# Altium schematic sheet 0026_DDR5 SODIMM CONTRO.SchDoc
size A3
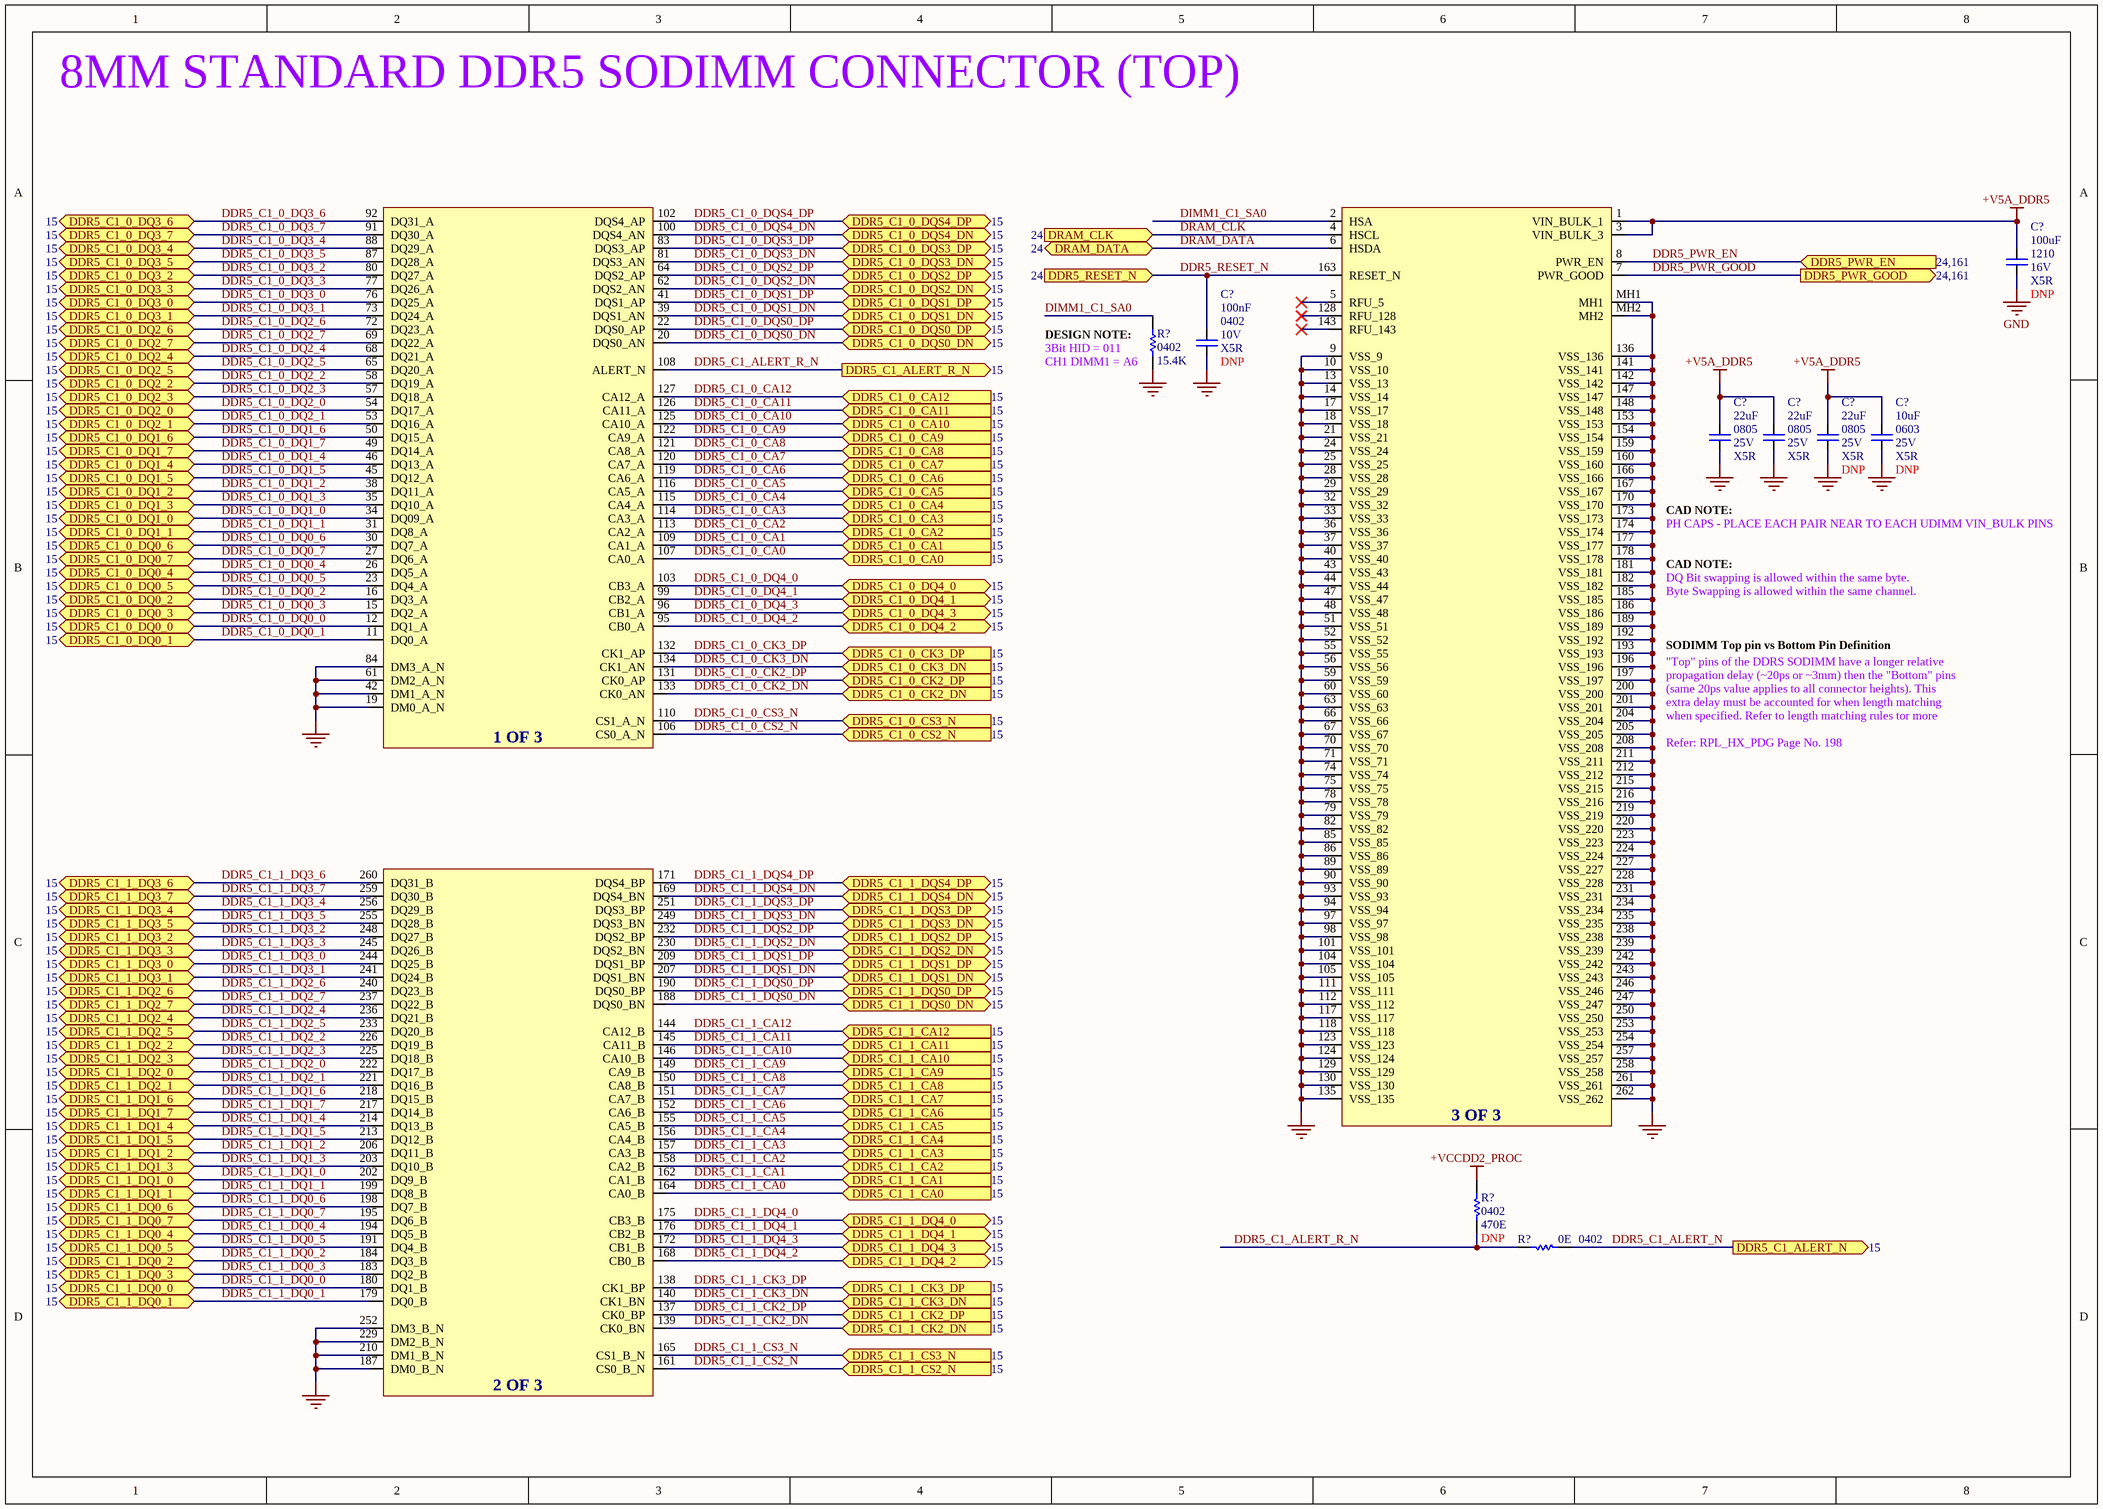
[diagram p0: 0026_DDR5 SODIMM CONTRO.SchDoc]

## Parts
(Parts that share a designator on the sheet are numbered #1, #2 ... from top to bottom, then left to right.)
C?#1  value 100uF  Case/Package: 1210  Voltage: 16V  Dielectric: X5R
C?#2  value 100nF  Case/Package: 0402  Voltage: 10V  Dielectric: X5R  [CAPC0402]
C?#3  value 22uF  Case/Package: 0805  Voltage: 25V  Dielectric: X5R  [capc0805]
C?#4  value 22uF  Case/Package: 0805  Voltage: 25V  Dielectric: X5R  [capc0805]
C?#5  value 22uF  Case/Package: 0805  Voltage: 25V  Dielectric: X5R  [capc0805]
C?#6  value 10uF  Case/Package: 0603  Voltage: 25V  Dielectric: X5R  [capc0603]
J?#1  C_DDR5_SODIMM_2X131_2EM  (value not drawn)  (part A of 3)
J?#2  C_DDR5_SODIMM_2X131_2EM  (value not drawn)  (part C of 3)
J?#3  C_DDR5_SODIMM_2X131_2EM  (value not drawn)  (part B of 3)
R?#1  value 15.4K  Case/Package: 0402  [RESC0402]  (hidden comment: Res)
R?#2  value 470E  Case/Package: 0402  [RESC0402]  (hidden comment: Res)
R?#3  value 0E  Case/Package: 0402  [RESC0402]  (hidden comment: Res)

## Ports
DDR5_C1_0_CA0 (in), DDR5_C1_0_CA1 (in), DDR5_C1_0_CA2 (in), DDR5_C1_0_CA3 (in), DDR5_C1_0_CA4 (in), DDR5_C1_0_CA5 (in), DDR5_C1_0_CA6 (in), DDR5_C1_0_CA7 (in), DDR5_C1_0_CA8 (in), DDR5_C1_0_CA9 (in), DDR5_C1_0_CA10 (in), DDR5_C1_0_CA11 (in), DDR5_C1_0_CA12 (in), DDR5_C1_0_CK2_DN (in), DDR5_C1_0_CK2_DP (in), DDR5_C1_0_CK3_DN (in), DDR5_C1_0_CK3_DP (in), DDR5_C1_0_CS2_N (in), DDR5_C1_0_CS3_N (in), DDR5_C1_0_DQ0_0 (bidir), DDR5_C1_0_DQ0_1 (bidir), DDR5_C1_0_DQ0_2 (bidir), DDR5_C1_0_DQ0_3 (bidir), DDR5_C1_0_DQ0_4 (bidir), DDR5_C1_0_DQ0_5 (bidir), DDR5_C1_0_DQ0_6 (bidir), DDR5_C1_0_DQ0_7 (bidir), DDR5_C1_0_DQ1_0 (bidir), DDR5_C1_0_DQ1_1 (bidir), DDR5_C1_0_DQ1_2 (bidir), DDR5_C1_0_DQ1_3 (bidir), DDR5_C1_0_DQ1_4 (bidir), DDR5_C1_0_DQ1_5 (bidir), DDR5_C1_0_DQ1_6 (bidir), DDR5_C1_0_DQ1_7 (bidir), DDR5_C1_0_DQ2_0 (bidir), DDR5_C1_0_DQ2_1 (bidir), DDR5_C1_0_DQ2_2 (bidir), DDR5_C1_0_DQ2_3 (bidir), DDR5_C1_0_DQ2_4 (bidir), DDR5_C1_0_DQ2_5 (bidir), DDR5_C1_0_DQ2_6 (bidir), DDR5_C1_0_DQ2_7 (bidir), DDR5_C1_0_DQ3_0 (bidir), DDR5_C1_0_DQ3_1 (bidir), DDR5_C1_0_DQ3_2 (bidir), DDR5_C1_0_DQ3_3 (bidir), DDR5_C1_0_DQ3_4 (bidir), DDR5_C1_0_DQ3_5 (bidir), DDR5_C1_0_DQ3_6 (bidir), DDR5_C1_0_DQ3_7 (bidir), DDR5_C1_0_DQ4_0 (bidir), DDR5_C1_0_DQ4_1 (bidir), DDR5_C1_0_DQ4_2 (bidir), DDR5_C1_0_DQ4_3 (bidir), DDR5_C1_0_DQS0_DN (bidir), DDR5_C1_0_DQS0_DP (bidir), DDR5_C1_0_DQS1_DN (bidir), DDR5_C1_0_DQS1_DP (bidir), DDR5_C1_0_DQS2_DN (bidir), DDR5_C1_0_DQS2_DP (bidir), DDR5_C1_0_DQS3_DN (bidir), DDR5_C1_0_DQS3_DP (bidir), DDR5_C1_0_DQS4_DN (bidir), DDR5_C1_0_DQS4_DP (bidir), DDR5_C1_1_CA0 (in), DDR5_C1_1_CA1 (in), DDR5_C1_1_CA2 (in), DDR5_C1_1_CA3 (in), DDR5_C1_1_CA4 (in), DDR5_C1_1_CA5 (in), DDR5_C1_1_CA6 (in), DDR5_C1_1_CA7 (in), DDR5_C1_1_CA8 (in), DDR5_C1_1_CA9 (in), DDR5_C1_1_CA10 (in), DDR5_C1_1_CA11 (in), DDR5_C1_1_CA12 (in), DDR5_C1_1_CK2_DN (in), DDR5_C1_1_CK2_DP (in), DDR5_C1_1_CK3_DN (in), DDR5_C1_1_CK3_DP (in), DDR5_C1_1_CS2_N (in), DDR5_C1_1_CS3_N (in), DDR5_C1_1_DQ0_0 (bidir), DDR5_C1_1_DQ0_1 (bidir), DDR5_C1_1_DQ0_2 (bidir), DDR5_C1_1_DQ0_3 (bidir), DDR5_C1_1_DQ0_4 (bidir), DDR5_C1_1_DQ0_5 (bidir), DDR5_C1_1_DQ0_6 (bidir), DDR5_C1_1_DQ0_7 (bidir), DDR5_C1_1_DQ1_0 (bidir), DDR5_C1_1_DQ1_1 (bidir), DDR5_C1_1_DQ1_2 (bidir), DDR5_C1_1_DQ1_3 (bidir), DDR5_C1_1_DQ1_4 (bidir), DDR5_C1_1_DQ1_5 (bidir), DDR5_C1_1_DQ1_6 (bidir), DDR5_C1_1_DQ1_7 (bidir), DDR5_C1_1_DQ2_0 (bidir), DDR5_C1_1_DQ2_1 (bidir), DDR5_C1_1_DQ2_2 (bidir), DDR5_C1_1_DQ2_3 (bidir), DDR5_C1_1_DQ2_4 (bidir), DDR5_C1_1_DQ2_5 (bidir), DDR5_C1_1_DQ2_6 (bidir), DDR5_C1_1_DQ2_7 (bidir), DDR5_C1_1_DQ3_0 (bidir), DDR5_C1_1_DQ3_1 (bidir), DDR5_C1_1_DQ3_2 (bidir), DDR5_C1_1_DQ3_3 (bidir), DDR5_C1_1_DQ3_4 (bidir), DDR5_C1_1_DQ3_5 (bidir), DDR5_C1_1_DQ3_6 (bidir), DDR5_C1_1_DQ3_7 (bidir), DDR5_C1_1_DQ4_0 (bidir), DDR5_C1_1_DQ4_1 (bidir), DDR5_C1_1_DQ4_2 (bidir), DDR5_C1_1_DQ4_3 (bidir), DDR5_C1_1_DQS0_DN (bidir), DDR5_C1_1_DQS0_DP (bidir), DDR5_C1_1_DQS1_DN (bidir), DDR5_C1_1_DQS1_DP (bidir), DDR5_C1_1_DQS2_DN (bidir), DDR5_C1_1_DQS2_DP (bidir), DDR5_C1_1_DQS3_DN (bidir), DDR5_C1_1_DQS3_DP (bidir), DDR5_C1_1_DQS4_DN (bidir), DDR5_C1_1_DQS4_DP (bidir), DDR5_C1_ALERT_N (out), DDR5_C1_ALERT_R_N (out), DDR5_PWR_EN (in), DDR5_PWR_GOOD (out), DDR5_RESET_N (in), DRAM_CLK (in), DRAM_DATA (bidir)

## Nets
+V5A_DDR5: C?#1.1 C?#3.1 C?#4.1 C?#5.1 C?#6.1 J?#2.1(VIN_BULK_1) J?#2.3(VIN_BULK_3)
+VCCDD2_PROC: R?#2.2
GND: C?#1.2 C?#2.2 C?#3.2 C?#4.2 C?#5.2 C?#6.2 J?#1.19(DM0_A_N) J?#1.42(DM1_A_N) J?#1.61(DM2_A_N) J?#1.84(DM3_A_N) J?#2.9(VSS_9) J?#2.10(VSS_10) J?#2.13(VSS_13) J?#2.14(VSS_14) J?#2.17(VSS_17) J?#2.18(VSS_18) J?#2.21(VSS_21) J?#2.24(VSS_24) J?#2.25(VSS_25) J?#2.28(VSS_28) J?#2.29(VSS_29) J?#2.32(VSS_32) J?#2.33(VSS_33) J?#2.36(VSS_36) J?#2.37(VSS_37) J?#2.40(VSS_40) J?#2.43(VSS_43) J?#2.44(VSS_44) J?#2.47(VSS_47) J?#2.48(VSS_48) J?#2.51(VSS_51) J?#2.52(VSS_52) J?#2.55(VSS_55) J?#2.56(VSS_56) J?#2.59(VSS_59) J?#2.60(VSS_60) J?#2.63(VSS_63) J?#2.66(VSS_66) J?#2.67(VSS_67) J?#2.70(VSS_70) J?#2.71(VSS_71) J?#2.74(VSS_74) J?#2.75(VSS_75) J?#2.78(VSS_78) J?#2.79(VSS_79) J?#2.82(VSS_82) J?#2.85(VSS_85) J?#2.86(VSS_86) J?#2.89(VSS_89) J?#2.90(VSS_90) J?#2.93(VSS_93) J?#2.94(VSS_94) J?#2.97(VSS_97) J?#2.98(VSS_98) J?#2.101(VSS_101) J?#2.104(VSS_104) J?#2.105(VSS_105) J?#2.111(VSS_111) J?#2.112(VSS_112) J?#2.117(VSS_117) J?#2.118(VSS_118) J?#2.123(VSS_123) J?#2.124(VSS_124) J?#2.129(VSS_129) J?#2.130(VSS_130) J?#2.135(VSS_135) J?#2.136(VSS_136) J?#2.141(VSS_141) J?#2.142(VSS_142) J?#2.147(VSS_147) J?#2.148(VSS_148) J?#2.153(VSS_153) J?#2.154(VSS_154) J?#2.159(VSS_159) J?#2.160(VSS_160) J?#2.166(VSS_166) J?#2.167(VSS_167) J?#2.170(VSS_170) J?#2.173(VSS_173) J?#2.174(VSS_174) J?#2.177(VSS_177) J?#2.178(VSS_178) J?#2.181(VSS_181) J?#2.182(VSS_182) J?#2.185(VSS_185) J?#2.186(VSS_186) J?#2.189(VSS_189) J?#2.192(VSS_192) J?#2.193(VSS_193) J?#2.196(VSS_196) J?#2.197(VSS_197) J?#2.200(VSS_200) J?#2.201(VSS_201) J?#2.204(VSS_204) J?#2.205(VSS_205) J?#2.208(VSS_208) J?#2.211(VSS_211) J?#2.212(VSS_212) J?#2.215(VSS_215) J?#2.216(VSS_216) J?#2.219(VSS_219) J?#2.220(VSS_220) J?#2.223(VSS_223) J?#2.224(VSS_224) J?#2.227(VSS_227) J?#2.228(VSS_228) J?#2.231(VSS_231) J?#2.234(VSS_234) J?#2.235(VSS_235) J?#2.238(VSS_238) J?#2.239(VSS_239) J?#2.242(VSS_242) J?#2.243(VSS_243) J?#2.246(VSS_246) J?#2.247(VSS_247) J?#2.250(VSS_250) J?#2.253(VSS_253) J?#2.254(VSS_254) J?#2.257(VSS_257) J?#2.258(VSS_258) J?#2.261(VSS_261) J?#2.262(VSS_262) J?#2.MH1 J?#2.MH2 J?#3.187(DM0_B_N) J?#3.210(DM1_B_N) J?#3.229(DM2_B_N) J?#3.252(DM3_B_N) R?#1.2
DDR5_C1_0_CA0: J?#1.107(CA0_A) ; port DDR5_C1_0_CA0
DDR5_C1_0_CA1: J?#1.109(CA1_A) ; port DDR5_C1_0_CA1
DDR5_C1_0_CA2: J?#1.113(CA2_A) ; port DDR5_C1_0_CA2
DDR5_C1_0_CA3: J?#1.114(CA3_A) ; port DDR5_C1_0_CA3
DDR5_C1_0_CA4: J?#1.115(CA4_A) ; port DDR5_C1_0_CA4
DDR5_C1_0_CA5: J?#1.116(CA5_A) ; port DDR5_C1_0_CA5
DDR5_C1_0_CA6: J?#1.119(CA6_A) ; port DDR5_C1_0_CA6
DDR5_C1_0_CA7: J?#1.120(CA7_A) ; port DDR5_C1_0_CA7
DDR5_C1_0_CA8: J?#1.121(CA8_A) ; port DDR5_C1_0_CA8
DDR5_C1_0_CA9: J?#1.122(CA9_A) ; port DDR5_C1_0_CA9
DDR5_C1_0_CA10: J?#1.125(CA10_A) ; port DDR5_C1_0_CA10
DDR5_C1_0_CA11: J?#1.126(CA11_A) ; port DDR5_C1_0_CA11
DDR5_C1_0_CA12: J?#1.127(CA12_A) ; port DDR5_C1_0_CA12
DDR5_C1_0_CK2_DN: J?#1.133(CK0_AN) ; port DDR5_C1_0_CK2_DN
DDR5_C1_0_CK2_DP: J?#1.131(CK0_AP) ; port DDR5_C1_0_CK2_DP
DDR5_C1_0_CK3_DN: J?#1.134(CK1_AN) ; port DDR5_C1_0_CK3_DN
DDR5_C1_0_CK3_DP: J?#1.132(CK1_AP) ; port DDR5_C1_0_CK3_DP
DDR5_C1_0_CS2_N: J?#1.106(CS0_A_N) ; port DDR5_C1_0_CS2_N
DDR5_C1_0_CS3_N: J?#1.110(CS1_A_N) ; port DDR5_C1_0_CS3_N
DDR5_C1_0_DQ0_0: J?#1.12(DQ1_A) ; port DDR5_C1_0_DQ0_0
DDR5_C1_0_DQ0_1: J?#1.11(DQ0_A) ; port DDR5_C1_0_DQ0_1
DDR5_C1_0_DQ0_2: J?#1.16(DQ3_A) ; port DDR5_C1_0_DQ0_2
DDR5_C1_0_DQ0_3: J?#1.15(DQ2_A) ; port DDR5_C1_0_DQ0_3
DDR5_C1_0_DQ0_4: J?#1.26(DQ5_A) ; port DDR5_C1_0_DQ0_4
DDR5_C1_0_DQ0_5: J?#1.23(DQ4_A) ; port DDR5_C1_0_DQ0_5
DDR5_C1_0_DQ0_6: J?#1.30(DQ7_A) ; port DDR5_C1_0_DQ0_6
DDR5_C1_0_DQ0_7: J?#1.27(DQ6_A) ; port DDR5_C1_0_DQ0_7
DDR5_C1_0_DQ1_0: J?#1.34(DQ09_A) ; port DDR5_C1_0_DQ1_0
DDR5_C1_0_DQ1_1: J?#1.31(DQ8_A) ; port DDR5_C1_0_DQ1_1
DDR5_C1_0_DQ1_2: J?#1.38(DQ11_A) ; port DDR5_C1_0_DQ1_2
DDR5_C1_0_DQ1_3: J?#1.35(DQ10_A) ; port DDR5_C1_0_DQ1_3
DDR5_C1_0_DQ1_4: J?#1.46(DQ13_A) ; port DDR5_C1_0_DQ1_4
DDR5_C1_0_DQ1_5: J?#1.45(DQ12_A) ; port DDR5_C1_0_DQ1_5
DDR5_C1_0_DQ1_6: J?#1.50(DQ15_A) ; port DDR5_C1_0_DQ1_6
DDR5_C1_0_DQ1_7: J?#1.49(DQ14_A) ; port DDR5_C1_0_DQ1_7
DDR5_C1_0_DQ2_0: J?#1.54(DQ17_A) ; port DDR5_C1_0_DQ2_0
DDR5_C1_0_DQ2_1: J?#1.53(DQ16_A) ; port DDR5_C1_0_DQ2_1
DDR5_C1_0_DQ2_2: J?#1.58(DQ19_A) ; port DDR5_C1_0_DQ2_2
DDR5_C1_0_DQ2_3: J?#1.57(DQ18_A) ; port DDR5_C1_0_DQ2_3
DDR5_C1_0_DQ2_4: J?#1.68(DQ21_A) ; port DDR5_C1_0_DQ2_4
DDR5_C1_0_DQ2_5: J?#1.65(DQ20_A) ; port DDR5_C1_0_DQ2_5
DDR5_C1_0_DQ2_6: J?#1.72(DQ23_A) ; port DDR5_C1_0_DQ2_6
DDR5_C1_0_DQ2_7: J?#1.69(DQ22_A) ; port DDR5_C1_0_DQ2_7
DDR5_C1_0_DQ3_0: J?#1.76(DQ25_A) ; port DDR5_C1_0_DQ3_0
DDR5_C1_0_DQ3_1: J?#1.73(DQ24_A) ; port DDR5_C1_0_DQ3_1
DDR5_C1_0_DQ3_2: J?#1.80(DQ27_A) ; port DDR5_C1_0_DQ3_2
DDR5_C1_0_DQ3_3: J?#1.77(DQ26_A) ; port DDR5_C1_0_DQ3_3
DDR5_C1_0_DQ3_4: J?#1.88(DQ29_A) ; port DDR5_C1_0_DQ3_4
DDR5_C1_0_DQ3_5: J?#1.87(DQ28_A) ; port DDR5_C1_0_DQ3_5
DDR5_C1_0_DQ3_6: J?#1.92(DQ31_A) ; port DDR5_C1_0_DQ3_6
DDR5_C1_0_DQ3_7: J?#1.91(DQ30_A) ; port DDR5_C1_0_DQ3_7
DDR5_C1_0_DQ4_0: J?#1.103(CB3_A) ; port DDR5_C1_0_DQ4_0
DDR5_C1_0_DQ4_1: J?#1.99(CB2_A) ; port DDR5_C1_0_DQ4_1
DDR5_C1_0_DQ4_2: J?#1.95(CB0_A) ; port DDR5_C1_0_DQ4_2
DDR5_C1_0_DQ4_3: J?#1.96(CB1_A) ; port DDR5_C1_0_DQ4_3
DDR5_C1_0_DQS0_DN: J?#1.20(DQS0_AN) ; port DDR5_C1_0_DQS0_DN
DDR5_C1_0_DQS0_DP: J?#1.22(DQS0_AP) ; port DDR5_C1_0_DQS0_DP
DDR5_C1_0_DQS1_DN: J?#1.39(DQS1_AN) ; port DDR5_C1_0_DQS1_DN
DDR5_C1_0_DQS1_DP: J?#1.41(DQS1_AP) ; port DDR5_C1_0_DQS1_DP
DDR5_C1_0_DQS2_DN: J?#1.62(DQS2_AN) ; port DDR5_C1_0_DQS2_DN
DDR5_C1_0_DQS2_DP: J?#1.64(DQS2_AP) ; port DDR5_C1_0_DQS2_DP
DDR5_C1_0_DQS3_DN: J?#1.81(DQS3_AN) ; port DDR5_C1_0_DQS3_DN
DDR5_C1_0_DQS3_DP: J?#1.83(DQS3_AP) ; port DDR5_C1_0_DQS3_DP
DDR5_C1_0_DQS4_DN: J?#1.100(DQS4_AN) ; port DDR5_C1_0_DQS4_DN
DDR5_C1_0_DQS4_DP: J?#1.102(DQS4_AP) ; port DDR5_C1_0_DQS4_DP
DDR5_C1_1_CA0: J?#3.164(CA0_B) ; port DDR5_C1_1_CA0
DDR5_C1_1_CA1: J?#3.162(CA1_B) ; port DDR5_C1_1_CA1
DDR5_C1_1_CA2: J?#3.158(CA2_B) ; port DDR5_C1_1_CA2
DDR5_C1_1_CA3: J?#3.157(CA3_B) ; port DDR5_C1_1_CA3
DDR5_C1_1_CA4: J?#3.156(CA4_B) ; port DDR5_C1_1_CA4
DDR5_C1_1_CA5: J?#3.155(CA5_B) ; port DDR5_C1_1_CA5
DDR5_C1_1_CA6: J?#3.152(CA6_B) ; port DDR5_C1_1_CA6
DDR5_C1_1_CA7: J?#3.151(CA7_B) ; port DDR5_C1_1_CA7
DDR5_C1_1_CA8: J?#3.150(CA8_B) ; port DDR5_C1_1_CA8
DDR5_C1_1_CA9: J?#3.149(CA9_B) ; port DDR5_C1_1_CA9
DDR5_C1_1_CA10: J?#3.146(CA10_B) ; port DDR5_C1_1_CA10
DDR5_C1_1_CA11: J?#3.145(CA11_B) ; port DDR5_C1_1_CA11
DDR5_C1_1_CA12: J?#3.144(CA12_B) ; port DDR5_C1_1_CA12
DDR5_C1_1_CK2_DN: J?#3.139(CK0_BN) ; port DDR5_C1_1_CK2_DN
DDR5_C1_1_CK2_DP: J?#3.137(CK0_BP) ; port DDR5_C1_1_CK2_DP
DDR5_C1_1_CK3_DN: J?#3.140(CK1_BN) ; port DDR5_C1_1_CK3_DN
DDR5_C1_1_CK3_DP: J?#3.138(CK1_BP) ; port DDR5_C1_1_CK3_DP
DDR5_C1_1_CS2_N: J?#3.161(CS0_B_N) ; port DDR5_C1_1_CS2_N
DDR5_C1_1_CS3_N: J?#3.165(CS1_B_N) ; port DDR5_C1_1_CS3_N
DDR5_C1_1_DQ0_0: J?#3.180(DQ1_B) ; port DDR5_C1_1_DQ0_0
DDR5_C1_1_DQ0_1: J?#3.179(DQ0_B) ; port DDR5_C1_1_DQ0_1
DDR5_C1_1_DQ0_2: J?#3.184(DQ3_B) ; port DDR5_C1_1_DQ0_2
DDR5_C1_1_DQ0_3: J?#3.183(DQ2_B) ; port DDR5_C1_1_DQ0_3
DDR5_C1_1_DQ0_4: J?#3.194(DQ5_B) ; port DDR5_C1_1_DQ0_4
DDR5_C1_1_DQ0_5: J?#3.191(DQ4_B) ; port DDR5_C1_1_DQ0_5
DDR5_C1_1_DQ0_6: J?#3.198(DQ7_B) ; port DDR5_C1_1_DQ0_6
DDR5_C1_1_DQ0_7: J?#3.195(DQ6_B) ; port DDR5_C1_1_DQ0_7
DDR5_C1_1_DQ1_0: J?#3.202(DQ9_B) ; port DDR5_C1_1_DQ1_0
DDR5_C1_1_DQ1_1: J?#3.199(DQ8_B) ; port DDR5_C1_1_DQ1_1
DDR5_C1_1_DQ1_2: J?#3.206(DQ11_B) ; port DDR5_C1_1_DQ1_2
DDR5_C1_1_DQ1_3: J?#3.203(DQ10_B) ; port DDR5_C1_1_DQ1_3
DDR5_C1_1_DQ1_4: J?#3.214(DQ13_B) ; port DDR5_C1_1_DQ1_4
DDR5_C1_1_DQ1_5: J?#3.213(DQ12_B) ; port DDR5_C1_1_DQ1_5
DDR5_C1_1_DQ1_6: J?#3.218(DQ15_B) ; port DDR5_C1_1_DQ1_6
DDR5_C1_1_DQ1_7: J?#3.217(DQ14_B) ; port DDR5_C1_1_DQ1_7
DDR5_C1_1_DQ2_0: J?#3.222(DQ17_B) ; port DDR5_C1_1_DQ2_0
DDR5_C1_1_DQ2_1: J?#3.221(DQ16_B) ; port DDR5_C1_1_DQ2_1
DDR5_C1_1_DQ2_2: J?#3.226(DQ19_B) ; port DDR5_C1_1_DQ2_2
DDR5_C1_1_DQ2_3: J?#3.225(DQ18_B) ; port DDR5_C1_1_DQ2_3
DDR5_C1_1_DQ2_4: J?#3.236(DQ21_B) ; port DDR5_C1_1_DQ2_4
DDR5_C1_1_DQ2_5: J?#3.233(DQ20_B) ; port DDR5_C1_1_DQ2_5
DDR5_C1_1_DQ2_6: J?#3.240(DQ23_B) ; port DDR5_C1_1_DQ2_6
DDR5_C1_1_DQ2_7: J?#3.237(DQ22_B) ; port DDR5_C1_1_DQ2_7
DDR5_C1_1_DQ3_0: J?#3.244(DQ25_B) ; port DDR5_C1_1_DQ3_0
DDR5_C1_1_DQ3_1: J?#3.241(DQ24_B) ; port DDR5_C1_1_DQ3_1
DDR5_C1_1_DQ3_2: J?#3.248(DQ27_B) ; port DDR5_C1_1_DQ3_2
DDR5_C1_1_DQ3_3: J?#3.245(DQ26_B) ; port DDR5_C1_1_DQ3_3
DDR5_C1_1_DQ3_4: J?#3.256(DQ29_B) ; port DDR5_C1_1_DQ3_4
DDR5_C1_1_DQ3_5: J?#3.255(DQ28_B) ; port DDR5_C1_1_DQ3_5
DDR5_C1_1_DQ3_6: J?#3.260(DQ31_B) ; port DDR5_C1_1_DQ3_6
DDR5_C1_1_DQ3_7: J?#3.259(DQ30_B) ; port DDR5_C1_1_DQ3_7
DDR5_C1_1_DQ4_0: J?#3.175(CB3_B) ; port DDR5_C1_1_DQ4_0
DDR5_C1_1_DQ4_1: J?#3.176(CB2_B) ; port DDR5_C1_1_DQ4_1
DDR5_C1_1_DQ4_2: J?#3.168(CB0_B) ; port DDR5_C1_1_DQ4_2
DDR5_C1_1_DQ4_3: J?#3.172(CB1_B) ; port DDR5_C1_1_DQ4_3
DDR5_C1_1_DQS0_DN: J?#3.188(DQS0_BN) ; port DDR5_C1_1_DQS0_DN
DDR5_C1_1_DQS0_DP: J?#3.190(DQS0_BP) ; port DDR5_C1_1_DQS0_DP
DDR5_C1_1_DQS1_DN: J?#3.207(DQS1_BN) ; port DDR5_C1_1_DQS1_DN
DDR5_C1_1_DQS1_DP: J?#3.209(DQS1_BP) ; port DDR5_C1_1_DQS1_DP
DDR5_C1_1_DQS2_DN: J?#3.230(DQS2_BN) ; port DDR5_C1_1_DQS2_DN
DDR5_C1_1_DQS2_DP: J?#3.232(DQS2_BP) ; port DDR5_C1_1_DQS2_DP
DDR5_C1_1_DQS3_DN: J?#3.249(DQS3_BN) ; port DDR5_C1_1_DQS3_DN
DDR5_C1_1_DQS3_DP: J?#3.251(DQS3_BP) ; port DDR5_C1_1_DQS3_DP
DDR5_C1_1_DQS4_DN: J?#3.169(DQS4_BN) ; port DDR5_C1_1_DQS4_DN
DDR5_C1_1_DQS4_DP: J?#3.171(DQS4_BP) ; port DDR5_C1_1_DQS4_DP
DDR5_C1_ALERT_N: R?#3.2 ; port DDR5_C1_ALERT_N
DDR5_C1_ALERT_R_N: J?#1.108(ALERT_N) R?#2.1 R?#3.1 ; port DDR5_C1_ALERT_R_N
DDR5_PWR_EN: J?#2.8(PWR_EN) ; port DDR5_PWR_EN
DDR5_PWR_GOOD: J?#2.7(PWR_GOOD) ; port DDR5_PWR_GOOD
DDR5_RESET_N: C?#2.1 J?#2.163(RESET_N) ; port DDR5_RESET_N
DIMM1_C1_SA0: J?#2.2(HSA) R?#1.1
DRAM_CLK: J?#2.4(HSCL) ; port DRAM_CLK
DRAM_DATA: J?#2.6(HSDA) ; port DRAM_DATA

Not connected (* = marked no-connect by the designer): J?#2 5(RFU_5)* 128(RFU_128)* 143(RFU_143)*

## Notes on the sheet
- 8MM STANDARD DDR5 SODIMM CONNECTOR (TOP)
- (near R?#1) 3Bit HID = 011
- (near R?#1) CH1 DIMM1 = A6
- (near R?#1) DESIGN NOTE:
- CAD NOTE:
- PH CAPS - PLACE EACH PAIR NEAR TO EACH UDIMM VIN_BULK PINS
- DQ Bit swapping is allowed within the same byte.
- Byte Swapping is allowed within the same channel.
- SODIMM Top pin vs Bottom Pin Definition
- "Top" pins of the DDRS SODIMM have a longer relative propagation delay (~20ps or ~3mm) then the "Bottom" pins (same 20ps value applies to all connector heights). This extra delay must be accounted for when length matching when specified. Refer to length matching rules tor more details
- Refer: RPL_HX_PDG Page No. 198
- (in symbol C_DDR5_SODIMM_2X131_2EM, part A) 1 OF 3
- (in symbol C_DDR5_SODIMM_2X131_2EM, part B) 2 OF 3
- (in symbol C_DDR5_SODIMM_2X131_2EM, part C) 3 OF 3

## Library data of the parts
C?#1 = Cap: CAP CER 100uF 16V X5R 1210; DNP: DNP
C?#2 = Cap: CAP CER 100nF 10V X5R 0402; DNP: DNP
C?#3-C?#5 = Cap: CAP CER 22uF 25V X5R 0805
  C?#5: DNP: DNP
C?#6 = Cap: CAP CER 10uF 25V X5R 0603; DNP: DNP
R?#1 = Res: Thick Film Resistor -  15.4Kohm, 1%, 0402
R?#2 = Res: Thick Film Resistor -  470ohm, 1%, 0402; DNP: DNP
R?#3 = Res: Thick Film Resistor -  0ohm, 1%, 0402
J?#1-J?#3 = C_DDR5_SODIMM_2X131_2EM: Manufacturer Part Number: *; Case/Package: *